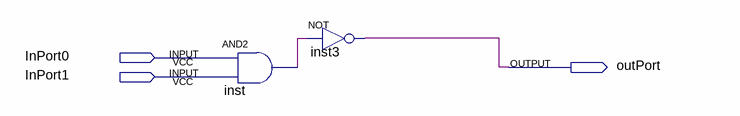
[diagram p0: schematic sheet]
// Quartus schematic GateDemo.bdf as structural Verilog: 2 symbols, 3 pins
module GateDemo (
  input  InPort0,
  input  InPort1,
  output outPort
);

  wire inst_out;

  and inst (inst_out, InPort0, InPort1);
  not inst3 (outPort, inst_out);
endmodule
